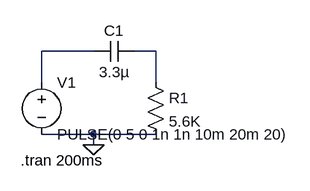
[diagram p0: schematic Differentiator.asc]
Differentiator.asc, the LTspice schematic file:
Version 4
SHEET 1 880 680
WIRE 32 96 -48 96
WIRE 128 96 96 96
WIRE -48 144 -48 96
WIRE 128 144 128 96
WIRE 32 224 -48 224
WIRE 128 224 32 224
WIRE 32 240 32 224
FLAG 32 240 0
SYMBOL cap 96 80 R90
WINDOW 0 0 32 VBottom 2
WINDOW 3 32 32 VTop 2
SYMATTR InstName C1
SYMATTR Value 3.3µ
SYMBOL res 112 128 R0
SYMATTR InstName R1
SYMATTR Value 5.6K
SYMBOL voltage -48 128 R0
WINDOW 123 0 0 Left 0
WINDOW 39 0 0 Left 0
SYMATTR InstName V1
SYMATTR Value PULSE(0 5 0 1n 1n 10m 20m 20)
TEXT -80 264 Left 2 !.tran 200ms

The netlist it stands for:
* Differentiator.asc
C1 N002 N001 3.3µ
R1 N002 0 5.6K
V1 N001 0 PULSE(0 5 0 1n 1n 10m 20m 20)
.tran 200ms
.backanno
.end